# Altium schematic sheet MCU.SchDoc
size A
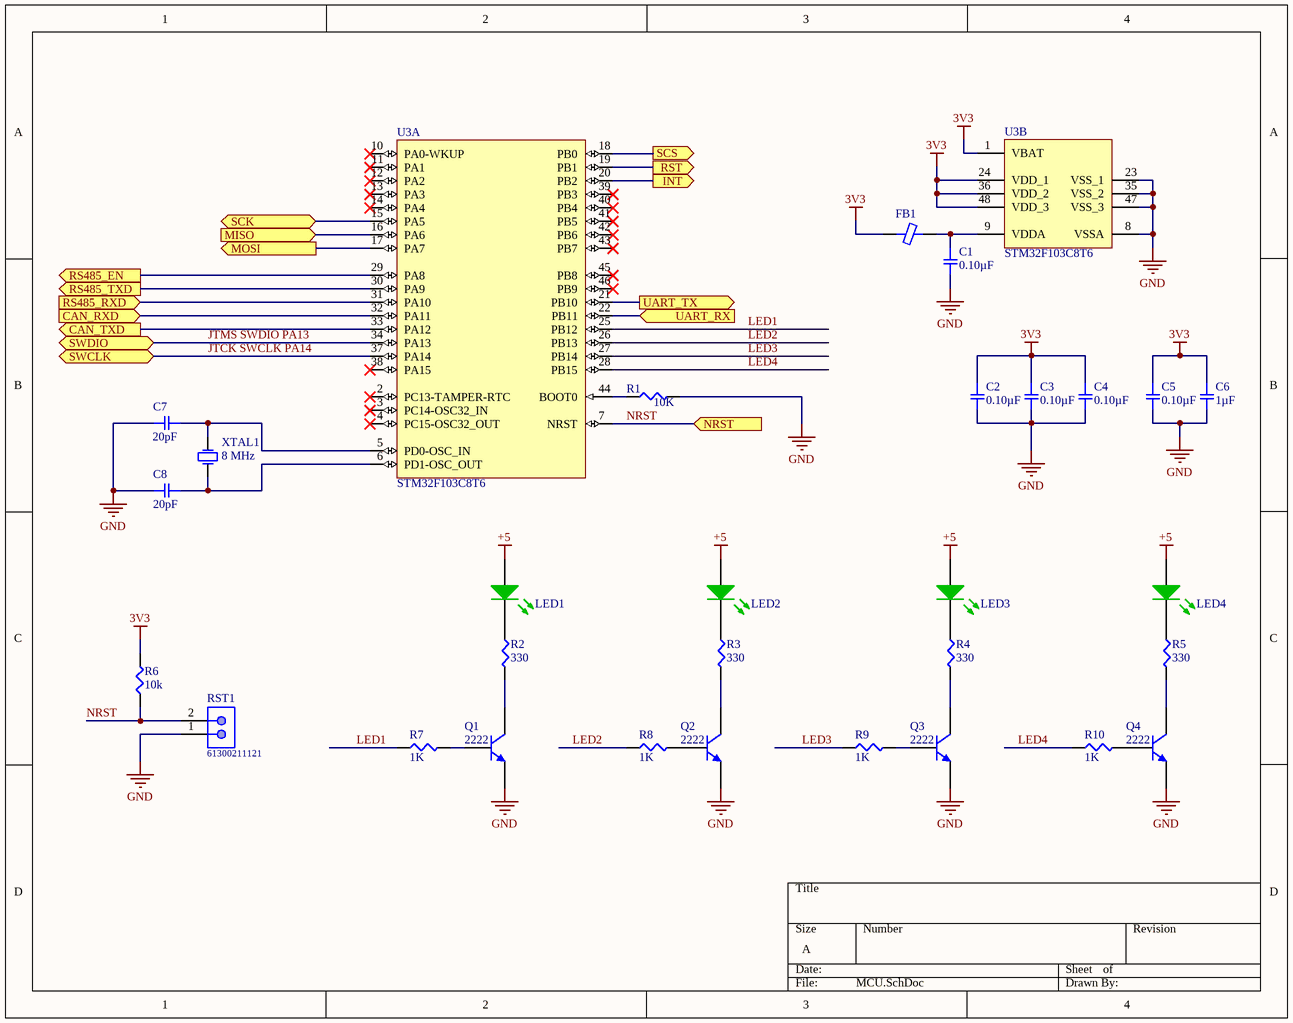
[diagram p0: MCU.SchDoc]

## Parts
C1  0.10µF  [0805]
C2  0.10µF  [0805]
C3  0.10µF  [0805]
C4  0.10µF  [0805]
C5  0.10µF  [0805]
C6  1µF  [0805]
C7  20pF  [0805]
C8  20pF  [0805]
FB1  (no value)  [0805]
LED1  LED-GREEN  [DIOSMD1206]  (value not drawn)
LED2  LED-GREEN  [DIOSMD1206]  (value not drawn)
LED3  LED-GREEN  [DIOSMD1206]  (value not drawn)
LED4  LED-GREEN  [DIOSMD1206]  (value not drawn)
Q1  2222  [SOT23-3]
Q2  2222  [SOT23-3]
Q3  2222  [SOT23-3]
Q4  2222  [SOT23-3]
R1  10K  [0805]
R2  330  [0805]
R3  330  [0805]
R4  330  [0805]
R5  330  [0805]
R6  10k  [0805]
R7  1K  [0805]
R8  1K  [0805]
R9  1K  [0805]
R10  1K  [0805]
RST1  61300211121  [61300211121]
U3  STM32F103C8T6  [STM-LQFP48_N]  (parts A,B of 2)
XTAL1  8 MHz  [CRYSTAL Small]

## Ports
CAN_RXD (in), CAN_TXD (out), INT (out), MISO (in), MOSI (out), NRST (in), RS485_EN (out), RS485_RXD (in), RS485_TXD (out), RST (out), SCK (bidir), SCS (out), SWCLK (bidir), SWDIO (bidir), UART_RX (in), UART_TX (out)

## Nets
3V3: C2.1 C3.1 C4.1 C5.1 C6.1 FB1.1 R6.2 U3.1(VBAT) U3.24(VDD_1) U3.36(VDD_2) U3.48(VDD_3)
+5: LED1.1(A) LED2.1(A) LED3.1(A) LED4.1(A)
GND: C1.2 C2.2 C3.2 C4.2 C5.2 C6.2 C7.2 C8.2 Q1.2(E) Q2.2(E) Q3.2(E) Q4.2(E) R1.2 RST1.1 U3.8(VSSA) U3.23(VSS_1) U3.35(VSS_2) U3.47(VSS_3)
CAN_RXD: U3.32(PA11) ; port CAN_RXD
CAN_TXD: U3.33(PA12) ; port CAN_TXD
INT: U3.20(PB2) ; port INT
JTCK SWCLK PA14: U3.37(PA14) ; port SWCLK
JTMS SWDIO PA13: U3.34(PA13) ; port SWDIO
LED1: R7.1 U3.25(PB12)
LED2: R8.1 U3.26(PB13)
LED3: R9.1 U3.27(PB14)
LED4: R10.1 U3.28(PB15)
MISO: U3.16(PA6) ; port MISO
MOSI: U3.17(PA7) ; port MOSI
NRST: R6.1 RST1.2 U3.7(NRST) ; port NRST
RS485_EN: U3.29(PA8) ; port RS485_EN
RS485_RXD: U3.31(PA10) ; port RS485_RXD
RS485_TXD: U3.30(PA9) ; port RS485_TXD
RST: U3.19(PB1) ; port RST
SCK: U3.15(PA5) ; port SCK
SCS: U3.18(PB0) ; port SCS
UART_RX: U3.22(PB11) ; port UART_RX
UART_TX: U3.21(PB10) ; port UART_TX
NetC1_1: C1.1 FB1.2 U3.9(VDDA)
NetC7_1: C7.1 U3.5(PD0-OSC_IN) XTAL1.2(OSC2)
NetC8_1: C8.1 U3.6(PD1-OSC_OUT) XTAL1.1(OSC1)
NetLED1_2: LED1.2(K) R2.1
NetLED2_2: LED2.2(K) R3.1
NetLED3_2: LED3.2(K) R4.1
NetLED4_2: LED4.2(K) R5.1
NetQ1_1: Q1.1(B) R7.2
NetQ1_3: Q1.3(C) R2.2
NetQ2_1: Q2.1(B) R8.2
NetQ2_3: Q2.3(C) R3.2
NetQ3_1: Q3.1(B) R9.2
NetQ3_3: Q3.3(C) R4.2
NetQ4_1: Q4.1(B) R10.2
NetQ4_3: Q4.3(C) R5.2
NetR1_1: R1.1 U3.44(BOOT0)

Not connected (* = marked no-connect by the designer): U3 2(PC13-TAMPER-RTC)* 3(PC14-OSC32_IN)* 4(PC15-OSC32_OUT)* 10(PA0-WKUP)* 11(PA1)* 12(PA2)* 13(PA3)* 14(PA4)* 38(PA15)* 39(PB3)* 40(PB4)* 41(PB5)* 42(PB6)* 43(PB7)* 45(PB8)* 46(PB9)*

## Library data of the parts
C1-C5 = GRM219R71E104KA01D: CAP CER 0.1UF 25V X7R 0805; Manufacturer: Murata Electronics North America; Factory Stock: 0; Unit Price (USD): 0.12; Minimum Quantity: 1; Tolerance: ±10%; Datasheets: http://www.murata.com/~/media/webrenewal/support/library/catalog/products/capacitor/mlcc/c02e.pdf; Image: //media.digikey.com/Renders/Murata%20Renders/0805%20(2012%20Metric)%20.85mm.jpg; Digi-Key Part Number: 490-12754-1-ND; Part Number: GRM219R71E104KA01D; Quantity Available: 8594; @ qty: 0; Packaging: Cut Tape (CT); Series: GRM; Part Status: Active; Value: 0.10µF; Voltage: 25V; Temperature Coefficient: X7R; Operating Temperature: -55°C ~ 125°C; Features: -; Ratings: -; Applications: General Purpose; Mounting Type: Surface Mount, MLCC; Package / Case: 0805 (2012 Metric); Size / Dimension: 0.079" L x 0.049" W (2.00mm x 1.25mm); Height - Seated (Max): -; Thickness (Max): 0.037" (0.95mm); Lead Spacing: -; Lead Style: -
C6 = GCM219R71C105KA37J: CAP CER 1.0UF 16V X7R 0805; Manufacturer: Murata Electronics North America; Factory Stock: 0; Unit Price (USD): 0.17; Minimum Quantity: 1; Tolerance: ±10%; Datasheets: http://www.murata.com/~/media/webrenewal/support/library/catalog/products/capacitor/mlcc/c03e.ashx; Image: //media.digikey.com/photos/Murata%20Photos/NCP,GCM%20SERIES%200805.jpg; Digi-Key Part Number: 490-12590-1-ND; Part Number: GCM219R71C105KA37J; Quantity Available: 7483; @ qty: 0; Packaging: Cut Tape (CT); Series: GCM; Part Status: Active; Value: 1µF; Voltage: 16V; Temperature Coefficient: X7R; Operating Temperature: -55°C ~ 125°C; Features: -; Ratings: AEC-Q200; Applications: Automotive; Mounting Type: Surface Mount, MLCC; Package / Case: 0805 (2012 Metric); Size / Dimension: 0.079" L x 0.049" W (2.00mm x 1.25mm); Height - Seated (Max): 0.037" (0.95mm); Thickness (Max): -; Lead Spacing: -
C7 C8 = GQM2195C1H200JB01D: CAP CER 20PF 50V NP0 0805; Manufacturer: Murata Electronics North America; Factory Stock: 0; Unit Price (USD): 0.78; Minimum Quantity: 1; Tolerance: ±5%; Temperature Coefficient: C0G, NP0; Datasheets: http://www.murata.com/~/media/webrenewal/support/library/catalog/products/capacitor/mlcc/c02e.pdf; Image: //media.digikey.com/Renders/Murata%20Renders/0805(GxM9).jpg; Digi-Key Part Number: 490-3607-1-ND; Part Number: GQM2195C1H200JB01D; Quantity Available: 270; @ qty: 0; Packaging: Cut Tape (CT); Series: GQM; Part Status: Active; Value: 20pF; Voltage: 50V; Operating Temperature: -55°C ~ 125°C; Features: High Q, Low Loss; Ratings: -; Applications: RF, Microwave, High Frequency; Mounting Type: Surface Mount, MLCC; Package / Case: 0805 (2012 Metric); Size / Dimension: 0.079" L x 0.049" W (2.00mm x 1.25mm); Height - Seated (Max): -; Thickness (Max): 0.037" (0.95mm); Lead Spacing: -; Lead Style: -
FB1 = 2508053007Y3: FERRITE BEAD 0805 1LN; Manufacturer: Fair-Rite Products Corp.; Current Rating (Max): 3A; DC Resistance (DCR) (Max): 30mOhm; Filter Type: Signal Line; Number of Lines: 1; Part Number: 2508053007Y3; ComponentLink1Description: Datasheet; ComponentLink1URL: http://www.fair-rite.com/wp-content/themes/fair-rite/print_product.php?pid=19169; ComponentLink2Description: DigiKey Link; ComponentLink2URL: http://digikey.com/product-detail/en/fair-rite-products-corp/2508053007Y3/1934-1399-1-ND/8594366; Device Package: 0805 (2012 Metric); Height (Max): 0.043" (1.10mm); LastUpdated: 1/21/2020 2:29:10 AM; Lifecycle Status: Active; Minimum Order: 1; Mounting Type: Surface Mount; Operating Temperature: -55°C ~ 125°C; Package / Case: 0805 (2012 Metric); Packaging: TapeAndReel; PartId: 1487; Part Status: Active; Price: 0.02; Series: -; Size / Dimension: 0.079" L x 0.049" W (2.00mm x 1.25mm); Supplier 1: DigiKey; Supplier Part Number 1: 1934-1399-1-ND
LED1-LED4 = LED-GREEN: General Propuse Ga/As LED; Supplier 1: Newark; Supplier 2: Digi-Key; Supplier 3: Mouser; Supplier 4: Farnell; Supplier 5: Mouser; Supplier Part Number 1: 95W3800; Supplier Part Number 2: 160-1423-6-ND; Supplier Part Number 3: 630-HSMM-C170; Supplier Part Number 4: 2322076; Supplier Part Number 5: 604-APT2012SGC
Q1-Q4 = BC817-25: NPN General Purpose Amplifier; Published: 8-Jun-2000; LatestRevisionDate: 20-Nov-2009; LatestRevisionNote: IPC-7351 Footprint Added.; DatasheetVersion: 1997; PackageVersion: Sep-1998; PackageReference: SOT-23A; Publisher: Altium Limited; PackageDescription: 3-Pin SOT-23 Package 0.95 mm Pitch, 2.3 mm Lead Span; ComponentLink1Description: Manufacturer Link; ComponentLink1URL: http://www.fairchildsemi.com/; ComponentLink2Description: Discontinuation Notice; ComponentLink2URL: http://www.fairchildsemi.com/obsolete/obs.jsp; Supplier 1: Mouser; Supplier 2: Digi-Key; Supplier Part Number 1: 863-BC817-25LT1G; Supplier Part Number 2: BC817-25-TPMSDKR-ND
R1 R6 = ERJ-6GEYJ103V: RES SMD 10K OHM 5% 1/8W 0805; Manufacturer: Panasonic Electronic Components; Factory Stock: 0; Unit Price (USD): 0.00496; @ qty: 1500; Minimum Quantity: 1; Power (Watts): 0.125W, 1/8W; Temperature Coefficient: ±200ppm/°C; Part Number: ERJ-6GEYJ103V; Datasheets: http://industrial.panasonic.com/www-cgi/jvcr13pz.cgi?E+PZ+3+AOA0001+ERJ6GEYJ103V+7+WW; Image: //media.digikey.com/Renders/Panasonic%20Renders/ERJ-0805%20Pkg.jpg; Digi-Key Part Number: P10KACT-ND; Quantity Available: 2328224; Packaging: Cut Tape (CT); Series: ERJ; Part Status: Active; Value: 10k; Tolerance: ±5%; Composition: Thick Film; Features: Automotive AEC-Q200; Operating Temperature: -55°C ~ 155°C; Package / Case: 0805 (2012 Metric); Supplier Device Package: 0805; Size / Dimension: 0.079" L x 0.049" W (2.00mm x 1.25mm); Height - Seated (Max): 0.028" (0.70mm); Number of Terminations: 2; Failure Rate: -
R2-R5 = ERJ-6GEYJ331V: RES SMD 330 OHM 5% 1/8W 0805; Manufacturer: Panasonic Electronic Components; Factory Stock: 0; Unit Price (USD): 0.00496; @ qty: 1500; Minimum Quantity: 1; Power (Watts): 0.125W, 1/8W; Temperature Coefficient: ±200ppm/°C; Part Number: ERJ-6GEYJ331V; Datasheets: http://industrial.panasonic.com/www-cgi/jvcr13pz.cgi?E+PZ+3+AOA0001+ERJ6GEYJ331V+7+WW; Image: //media.digikey.com/Renders/Panasonic%20Renders/ERJ-0805%20Pkg.jpg; Digi-Key Part Number: P330ACT-ND; Quantity Available: 212236; Packaging: Cut Tape (CT); Series: ERJ; Part Status: Active; Value: 330; Tolerance: ±5%; Composition: Thick Film; Features: Automotive AEC-Q200; Operating Temperature: -55°C ~ 155°C; Package / Case: 0805 (2012 Metric); Supplier Device Package: 0805; Size / Dimension: 0.079" L x 0.049" W (2.00mm x 1.25mm); Height - Seated (Max): 0.028" (0.70mm); Number of Terminations: 2; Failure Rate: -
R7-R10 = ERJ-6GEYJ331V: RES SMD 330 OHM 5% 1/8W 0805; Manufacturer: Panasonic Electronic Components; Factory Stock: 0; Unit Price (USD): 0.00496; @ qty: 1500; Minimum Quantity: 1; Value: 330; Power (Watts): 0.125W, 1/8W; Temperature Coefficient: ±200ppm/°C; Part Number: ERJ-6GEYJ331V; Datasheets: http://industrial.panasonic.com/www-cgi/jvcr13pz.cgi?E+PZ+3+AOA0001+ERJ6GEYJ331V+7+WW; Image: //media.digikey.com/Renders/Panasonic%20Renders/ERJ-0805%20Pkg.jpg; Digi-Key Part Number: P330ACT-ND; Quantity Available: 212236; Packaging: Cut Tape (CT); Series: ERJ; Part Status: Active; Tolerance: ±5%; Composition: Thick Film; Features: Automotive AEC-Q200; Operating Temperature: -55°C ~ 155°C; Package / Case: 0805 (2012 Metric); Supplier Device Package: 0805; Size / Dimension: 0.079" L x 0.049" W (2.00mm x 1.25mm); Height - Seated (Max): 0.028" (0.70mm); Number of Terminations: 2; Failure Rate: -
RST1 = 61300211121: WR-PHD Pin Header, THT, pitch 2.54mm, Single Row, Vertical, 2pin; Pin Number: 2; Gender: Male; Rated Current: 3A; Working Voltage: 250VAC; Withstanding Voltage: 500VAC; Contact Resistance: 20mOhm; ComponentLink1Description: Manufacturer; ComponentLink1URL: http://www.we-online.de; ComponentLink2Description: Datasheet; ComponentLink2URL: https://katalog.we-online.de/em/datasheet/6130xx11121.pdf; Part Number: 61300211121; Published Date: June 2019; Publisher: Wurth Elektronik; Pitch: 2.54mm; Operating Temperature: -40 to +105degC; Mounting Technology: THT; Packaging: Bag; Row Number: Single; Orientation: Vertical
U3 = STM32F103C8T6: ARM Cortex-M3 32-bit MCU, 64 KB Flash, 20 KB Internal RAM, 37 I/Os, 48-pin LQFP, -40 to 85 degC, Tray; A/D Converter: 2x12-bit (10 Channel); FLASH Size (Prog) (kB): 64; I/Os (High Current): 37; Internal RAM Size (kB): 20; Operating Frequency(F) (Processor speed) (MHz): 72; Supply Voltage(Vcc) min (V): 2; DatasheetVersion: Rev. 16; PackageVersion: Rev. 6, 06/2013; PackageReference: LQFP48; PackageDescription: 48-Pin Low Profile Quad Flat Package, 7 x 7 mm Body, 0.5 mm Pitch; Supplier 1: Digi-Key; Supplier Part Number 1: 497-6063-ND; Supplier 2: Farnell; Supplier Part Number 2: 1447637; Supplier 3: Newark; Supplier Part Number 3: 59M2182; Supplier 4: Newark; Supplier Part Number 4: 57P1222; Supplier 5: Mouser; Supplier Part Number 5: 511-STM32F103C8T6; Core: ARM Cortex-M3; Packing: Tray; Mounting Technology: Surface Mount; PartNumber: STM32F103C8T6; ComponentLink1Description: Manufacturer URL; ComponentLink1URL: http://www.st.com/web/en/home.html; ComponentLink2Description: Datasheet; ComponentLink2URL: http://www.st.com/st-web-ui/static/active/en/resource/technical/document/datasheet/CD00161566.pdf; ComponentLink3Description: Package Specification; ComponentLink3URL: http://www.st.com/st-web-ui/static/active/en/resource/technical/document/datasheet/DM00058181.pdf
XTAL1 = XTAL: XTAL Crystal; Designer: ABBAS BASEREH; Value: 12 MHz; Design Date: 2017-1-3; ComponentLink1Description: Datasheet; ComponentLink2Description: Reference; Mounting Technology: Surface Mount\Through-Hole; Status: Unreleased